# EAGLE board Krakatau Board v1.3 (EAGLE 9.6.0)
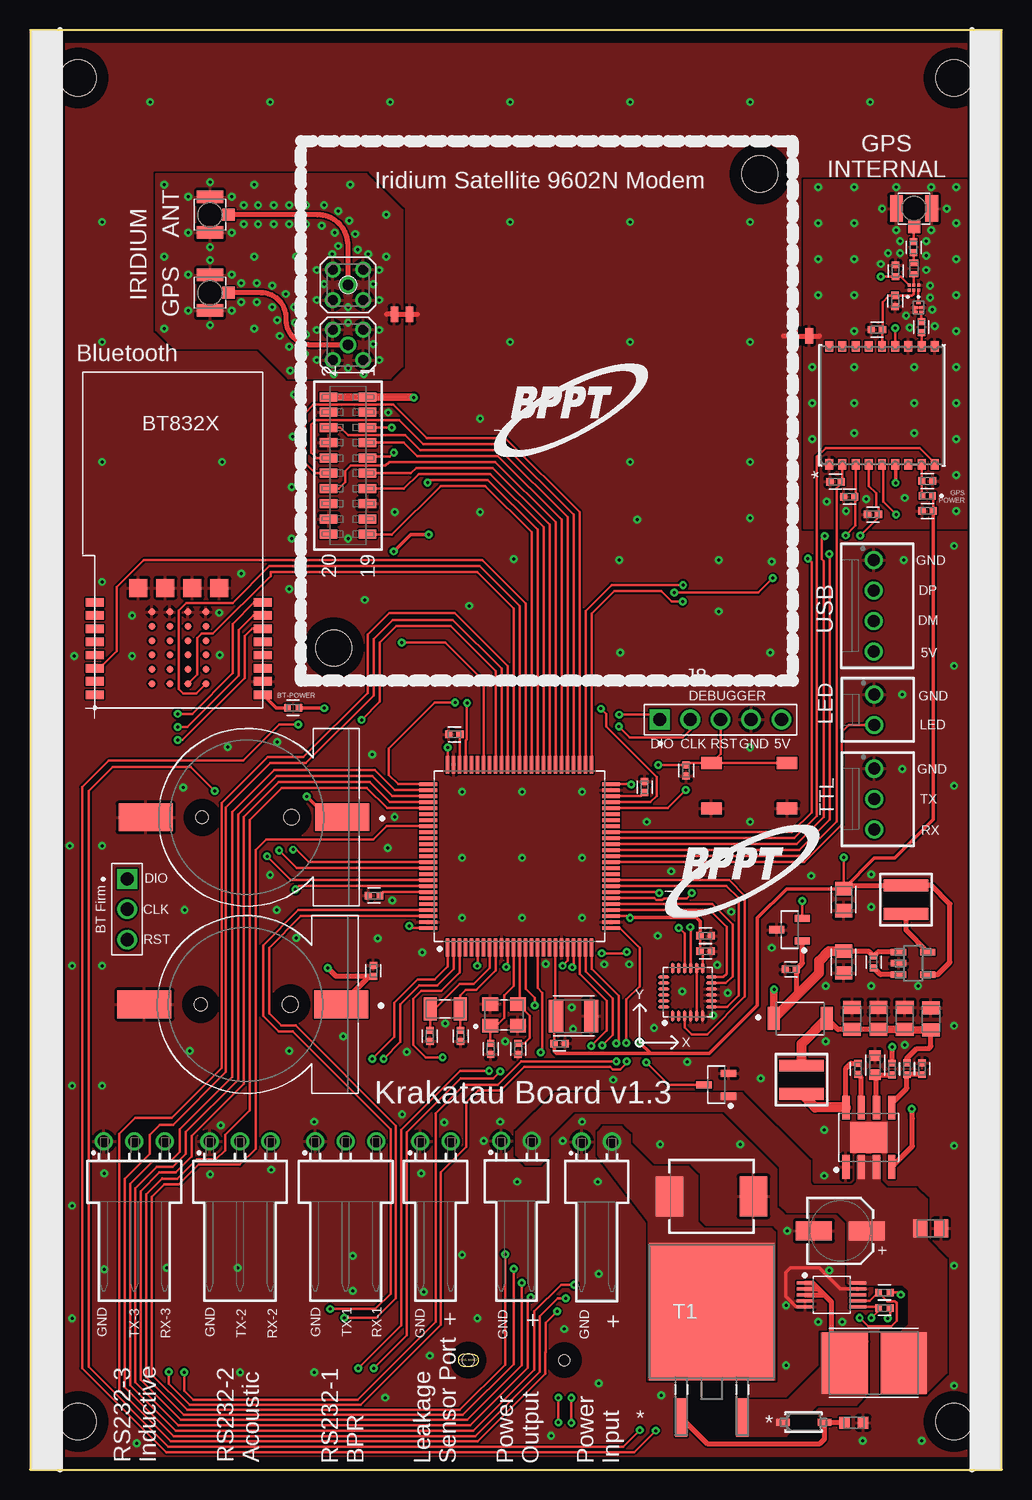
[diagram p7: board, top side]
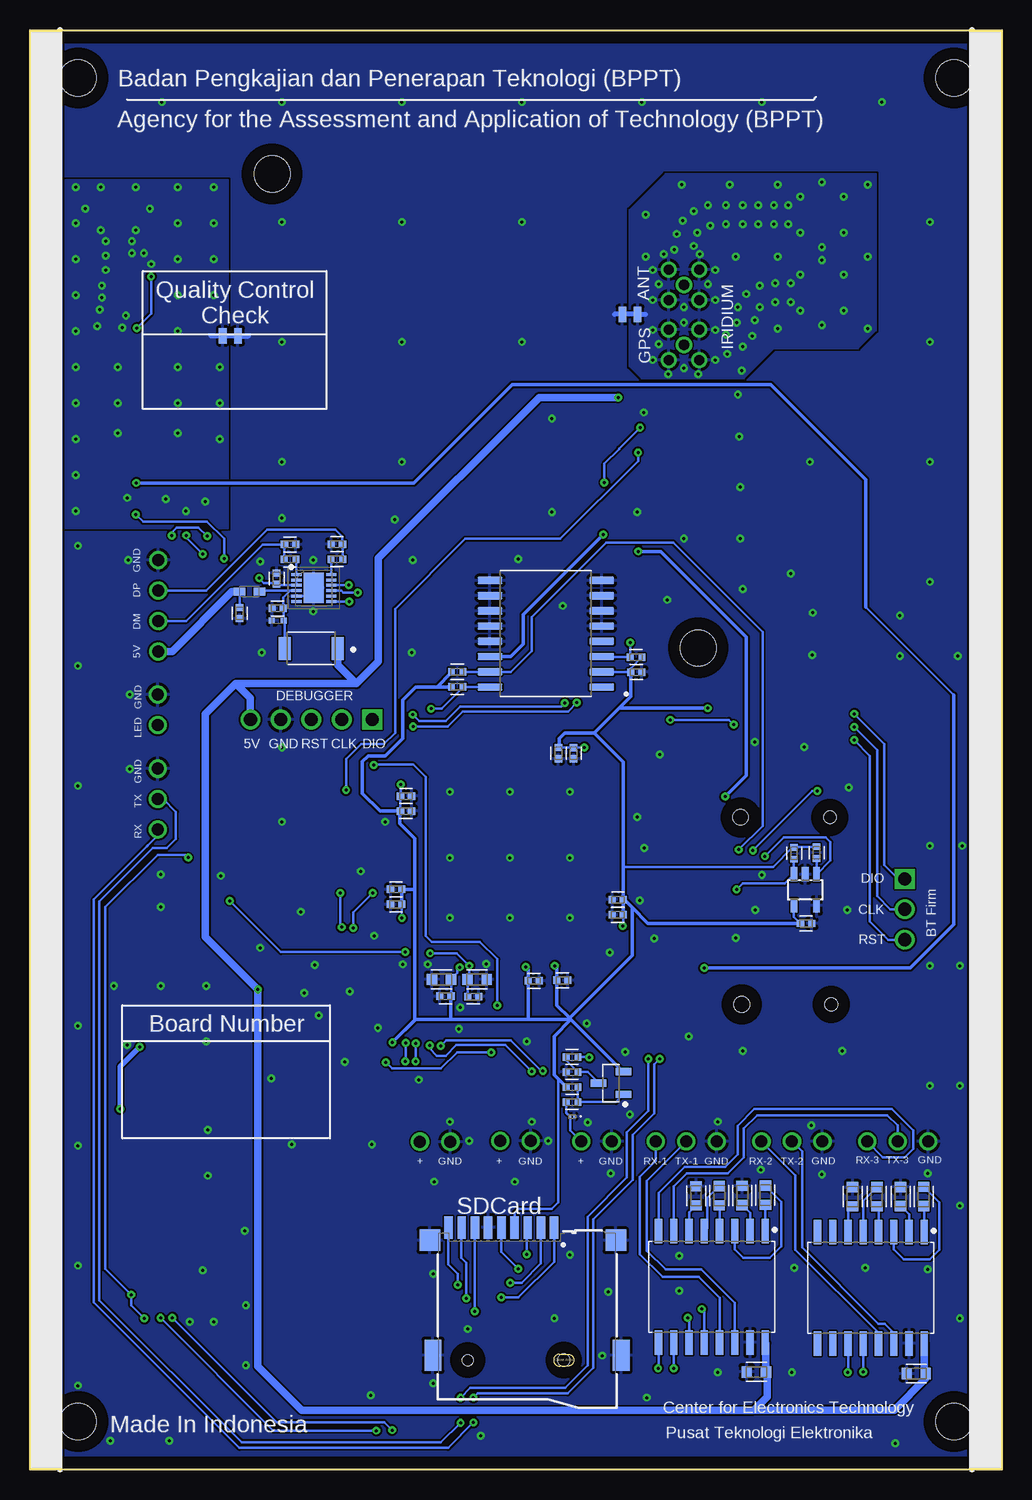
[diagram p8: board, bottom side, seen from below]

Size 81 x 120 mm. Coordinates in mm from the lower left corner, seen from the top.
Outline: 81,0 81,120 0,120 0,0 81,0
Copper layers (1*16): Top 0.035mm / dielectric 1.5mm / Bottom 0.035mm
Design rules "default *": minimum track width 6mil, minimum drill 0.2mm, track to track 6mil, track to pad 6mil, pad to pad 6mil, via to via 6mil, smd to smd 6mil, copper to edge 40mil, drill to drill 6mil, minimum pad ring 10mil, minimum via ring 8mil, stop-mask expansion 6mil, vias tented up to drill 13mil, thermal gap 10mil
Holes 3 mm at 25.31,68.49 60.82,108 77,4 4,4 4,116 77,116

## Footprints (pad centres in the part's own frame; a part is rotated, then mirrored left to right if it is on the bottom)
BAT_S8411-45R = smd 2.3 x 4.5: N 0,8.425; P 0,-7.975 | hole 1.3: 0,-3.725 | hole 1.05: 0,3.725
CAPC1005X50N-0402-KEMET = smd 0.598 x 0.623: 1 -0.463,0; 2 0.463,0
CAPC3225X90N-1210-KEMET = smd 1.185 x 2.715: 1 -1.465,0; 2 1.465,0
CAPC1608X80N-0603-KEMET = smd 0.86 x 0.95: 1 -0.795,0; 2 0.795,0
CAPC2113X90N-0805-KEMET = smd 1.11 x 1.4: 1 -0.91,0; 2 0.91,0
WCAP-AS5H_5X5.5(DXL) = smd 3 x 1.6: 1 2.2,0; 2 -2.2,0
CAPC2012X100N = smd 1.16 x 1.47: 1 -0.875,0; 2 0.875,0
CAPC2113X95N = smd 1.1 x 1.48: 1 -0.913,0; 2 0.913,0
WCAP-CSGP_0402 = smd 0.5 x 0.5: 1 0.5,0; 2 -0.5,0
WE-TVSP_DO-214AB_BIDIRECTIONAL = smd 2.3 x 3.3: 1 -3.5,0; 2 3.5,0
SODFL4725X110N = smd 0.99 x 1.92: A 2.21,0; C -2.21,0
SOD123_DIO = smd 1.111 x 0.601: 1 -1.725,0; 2 1.725,0
DIODFN58X28X16-2N = smd 0.22 x 0.28: 1 -0.18,0; 2 0.18,0
FIL_F6QA1G582H2JM-J = smd 0.25 x 0.35: 1 -0.4,0; 2 0,-0.25; 3 0.4,-0.25; 4 0.4,0.25; 5 0,0.25
MMCX-P-P-X-ST-TH1 = drill 0.84 pad 1.3: 1 0,0; 2 -1.27,1.27; 3 -1.27,-1.27; 4 1.27,1.27; 5 1.27,-1.27
61900211021 = drill 1: 1 -1.27,3.35; 2 1.27,3.35
61900311021 = drill 1: 1 -2.54,3.35; 2 0,3.35; 3 2.54,3.35
61300511121 = drill 1.1 square: 1 -5.08,0 | drill 1.1: 2 -2.54,0; 3 0,0; 4 2.54,0; 5 5.08,0
61900411121 = drill 1: 1 3.81,0.3; 2 1.27,0.3; 3 -1.27,0.3; 4 -3.81,0.3
693071020811 = smd 0.7 x 1.9: 1 2.25,11.05; 2 1.15,11.05; 3 0.05,11.05; 4 -1.05,11.05; 5 -2.15,11.05; 6 -3.25,11.05; 7 -4.35,11.05; 8 -5.45,11.05; 9 -6.55,11.05 | smd 1.7 x 1.8: 10 -8.1,10; 11 7.4,10 | smd 1.4 x 2.6: 12 -7.85,0.4; 13 7.85,0.4 | hole 0.9: -4.95,0 | hole 1: 3.05,0
SAMTEC-CLP-110-02-X-D = smd 0.74 x 1.47: 1 -5.715,1.613; 2 -5.715,-1.613; 3 -4.445,1.613; 4 -4.445,-1.613; 5 -3.175,1.613; 6 -3.175,-1.613; 7 -1.905,1.613; 8 -1.905,-1.613; 9 -0.635,1.613; 10 -0.635,-1.613; 11 0.635,1.613; 12 0.635,-1.613; 13 1.905,1.613; 14 1.905,-1.613; 15 3.175,1.613; 16 3.175,-1.613; 17 4.445,1.613; 18 4.445,-1.613; 19 5.715,1.613; 20 5.715,-1.613
61900211121 = drill 1: 1 1.27,0.3; 2 -1.27,0.3
61900311121 = drill 1: 1 2.54,0.3; 2 0,0.3; 3 -2.54,0.3
61300311121 = drill 1.1 square: 1 -2.54,0 | drill 1.1: 2 0,0; 3 2.54,0
WE-MAIA_4020 = smd 0.98 x 3.7: 1 -1.185,0; 2 1.185,0
WE-CBF_0603(W=2.6) = smd 0.95 x 0.7: 1 -0.825,0; 2 0.825,0
INDC1005X55N = smd 0.54 x 0.6: 1 -0.432,0; 2 0.432,0
INDC1006X60N = smd 0.51 x 0.73: 1 -0.46,0; 2 0.46,0
RESC1005X35N-0402-VISHAYDALE = smd 0.555 x 0.623: 1 -0.484,0; 2 0.484,0
RESC1005X30N = smd 0.555 x 0.623: 1 -0.484,0; 2 0.484,0
RESC1608X55N = smd 0.87 x 0.98: 1 -0.78,0; 2 0.78,0
RESM7149X165NR = smd 3.838 x 5.112: 1 -2.389,0; 2 2.515,0
2PT_GND_TIE = smd 1.27 x 0.635: P$1 0,0.635; P$2 0,-0.635
SW_TL3342F160QG = smd 1.7 x 1: 1 -3.15,-1.9; 2 3.15,-1.9; 3 -3.15,1.9; 4 3.15,1.9
TO-263AB_SUM = smd 0.991 x 3.2: 1 -2.54,-8.877; 3 2.54,-8.877 | smd 10.414 x 11.455: 2 0,-0.051
QFP50P1590X1590X160-100N = smd 1.488 x 0.28: 1 -7.62,6; 2 -7.62,5.5; 3 -7.62,5; 4 -7.62,4.5; 5 -7.62,4; 6 -7.62,3.5; 7 -7.62,3; 8 -7.62,2.5; 9 -7.62,2; 10 -7.62,1.5; 11 -7.62,1; 12 -7.62,0.5; 13 -7.62,0; 14 -7.62,-0.5; 15 -7.62,-1; 16 -7.62,-1.5; 17 -7.62,-2; 18 -7.62,-2.5; 19 -7.62,-3; 20 -7.62,-3.5; 21 -7.62,-4; 22 -7.62,-4.5; 23 -7.62,-5; 24 -7.62,-5.5; 25 -7.62,-6; 51 7.62,-6; 52 7.62,-5.5; 53 7.62,-5; 54 7.62,-4.5; 55 7.62,-4; 56 7.62,-3.5; 57 7.62,-3; 58 7.62,-2.5; 59 7.62,-2; 60 7.62,-1.5; 61 7.62,-1; 62 7.62,-0.5; 63 7.62,0; 64 7.62,0.5; 65 7.62,1; 66 7.62,1.5; 67 7.62,2; 68 7.62,2.5; 69 7.62,3; 70 7.62,3.5; 71 7.62,4; 72 7.62,4.5; 73 7.62,5; 74 7.62,5.5; 75 7.62,6 | smd 0.28 x 1.488: 26 -6,-7.62; 27 -5.5,-7.62; 28 -5,-7.62; 29 -4.5,-7.62; 30 -4,-7.62; 31 -3.5,-7.62; 32 -3,-7.62; 33 -2.5,-7.62; 34 -2,-7.62; 35 -1.5,-7.62; 36 -1,-7.62; 37 -0.5,-7.62; 38 0,-7.62; 39 0.5,-7.62; 40 1,-7.62; 41 1.5,-7.62; 42 2,-7.62; 43 2.5,-7.62; 44 3,-7.62; 45 3.5,-7.62; 46 4,-7.62; 47 4.5,-7.62; 48 5,-7.62; 49 5.5,-7.62; 50 6,-7.62; 76 6,7.62; 77 5.5,7.62; 78 5,7.62; 79 4.5,7.62; 80 4,7.62; 81 3.5,7.62; 82 3,7.62; 83 2.5,7.62; 84 2,7.62; 85 1.5,7.62; 86 1,7.62; 87 0.5,7.62; 88 0,7.62; 89 -0.5,7.62; 90 -1,7.62; 91 -1.5,7.62; 92 -2,7.62; 93 -2.5,7.62; 94 -3,7.62; 95 -3.5,7.62; 96 -4,7.62; 97 -4.5,7.62; 98 -5,7.62; 99 -5.5,7.62; 100 -6,7.62
SOT95P284X122-5N = smd 1.27 x 0.533: 1 -1.219,0.94; 2 -1.219,0; 3 -1.219,-0.94; 4 1.219,-0.94; 5 1.219,0.94
SOIC127P600X170-9T260X310N = smd 1.968 x 0.599: 1 -2.473,1.905; 2 -2.473,0.635; 3 -2.473,-0.635; 4 -2.473,-1.905; 5 2.473,-1.905; 6 2.473,-0.635; 7 2.473,0.635; 8 2.473,1.905 | smd 2.6 x 3.1: 9 0,0
SOT95P237X112-3N = smd 1.24 x 0.589: 1 -1.056,0.95; 2 -1.056,-0.95; 3 1.056,0
BT832X = smd 1.5 x 0.7: P$1 0,8.8; P$2 0,7.7; P$3 0,6.6; P$4 0,5.5; P$5 0,4.4; P$6 0,3.3; P$7 0,2.2; P$8 0,1.1; P$9 14,1.1; P$10 14,2.2; P$11 14,3.3; P$12 14,4.4; P$13 14,5.5; P$14 14,6.6; P$15 14,7.7; P$16 14,8.8 | smd 0.6 x 0.6: P$A0 4.75,8; P$A1 4.75,6.8; P$A2 4.75,5.6; P$A3 4.75,4.4; P$A4 4.75,3.2; P$A5 4.75,2; P$B0 6.25,8; P$B1 6.25,6.8; P$B2 6.25,5.6; P$B3 6.25,4.4; P$B4 6.25,3.2; P$B5 6.25,2; P$C0 7.75,8; P$C1 7.75,6.8; P$C2 7.75,5.6; P$C3 7.75,4.4; P$C4 7.75,3.2; P$C5 7.75,2; P$D0 9.25,8; P$D1 9.25,6.8; P$D2 9.25,5.6; P$D3 9.25,4.4; P$D4 9.25,3.2; P$D5 9.25,2 | smd 1.5 x 1.5: P$F0 3.63,10; P$F1 5.88,10; P$F2 8.13,10; P$F3 10.38,10
SOIC127P1030X265-16N = smd 2.056 x 0.599: 1 -4.642,4.445; 2 -4.642,3.175; 3 -4.642,1.905; 4 -4.642,0.635; 5 -4.642,-0.635; 6 -4.642,-1.905; 7 -4.642,-3.175; 8 -4.642,-4.445; 9 4.642,-4.445; 10 4.642,-3.175; 11 4.642,-1.905; 12 4.642,-0.635; 13 4.642,0.635; 14 4.642,1.905; 15 4.642,3.175; 16 4.642,4.445
SON45P300X300X75-13N = smd 0.85 x 0.25: 1 -1.45,1.125; 2 -1.45,0.675; 3 -1.45,0.225; 4 -1.45,-0.225; 5 -1.45,-0.675; 6 -1.45,-1.125; 7 1.45,-1.125; 8 1.45,-0.675; 9 1.45,-0.225; 10 1.45,0.225; 11 1.45,0.675; 12 1.45,1.125 | smd 1.65 x 2.55: 13 0,0
SOT95P237X110-3 = smd 1.298 x 0.602: 1 -1.027,0.95; 2 -1.027,-0.95; 3 1.027,0
LCC18_9P7X10P1 = smd 0.876 x 0.66: 1 -4.921,4.4; 2 -4.921,3.3; 3 -4.921,2.2; 4 -4.921,1.1; 5 -4.921,0; 6 -4.921,-1.1; 7 -4.921,-2.2; 8 -4.921,-3.3; 9 -4.921,-4.4; 10 4.921,-4.4; 11 4.921,-3.3; 12 4.921,-2.2; 13 4.921,-1.1; 14 4.921,0; 15 4.921,1.1; 16 4.921,2.2; 17 4.921,3.3; 18 4.921,4.4
INF-TSLP-6-2_V_1PRIMARY = smd 0.25 x 0.25: 1 -0.2,0.4; 2 -0.2,0; 3 -0.2,-0.4; 4 0.2,-0.4; 5 0.2,0; 6 0.2,0.4
SOIC127P1032X265-16N = smd 2.05 x 0.59: 1 -4.655,4.445; 2 -4.655,3.175; 3 -4.655,1.905; 4 -4.655,0.635; 5 -4.655,-0.635; 6 -4.655,-1.905; 7 -4.655,-3.175; 8 -4.655,-4.445; 9 4.655,-4.445; 10 4.655,-3.175; 11 4.655,-1.905; 12 4.655,-0.635; 13 4.655,0.635; 14 4.655,1.905; 15 4.655,3.175; 16 4.655,4.445
SOT23-5L = smd 0.55 x 1.2: GND 0,-1.3; SCL -0.95,-1.3; SDA 0.95,-1.3; VCC 0.95,1.3; WP -0.95,1.3
SOP50P490X110-10N = smd 1.396 x 0.28: 1 -2.187,1; 2 -2.187,0.5; 3 -2.187,0; 4 -2.187,-0.5; 5 -2.187,-1; 6 2.187,-1; 7 2.187,-0.5; 8 2.187,0; 9 2.187,0.5; 10 2.187,1
QFN50P400X400X100-24 = smd 0.96 x 0.27: 1 -1.985,1.25; 2 -1.985,0.75; 3 -1.985,0.25; 4 -1.985,-0.25; 5 -1.985,-0.75; 6 -1.985,-1.25; 13 1.985,-1.25; 14 1.985,-0.75; 15 1.985,-0.25; 16 1.985,0.25; 17 1.985,0.75; 18 1.985,1.25 | smd 0.27 x 0.96: 7 -1.25,-1.985; 8 -0.75,-1.985; 9 -0.25,-1.985; 10 0.25,-1.985; 11 0.75,-1.985; 12 1.25,-1.985; 19 1.25,1.985; 20 0.75,1.985; 21 0.25,1.985; 22 -0.25,1.985; 23 -0.75,1.985; 24 -1.25,1.985
XTAL_ECS-250-20-33-CKM-TR = smd 1.3 x 1.1: 1 -1.15,-0.9; 2 1.15,-0.9; 3 1.15,0.9; 4 -1.15,0.9
XTAL_ECS-.327-12.5-34B-TR = smd 1.1 x 1.9: 1 -1.25,0; 2 1.25,0
HRS_U.FL-R-SMT-1(10) = smd 1.05 x 2.2: 1 -1.475,0; 3 1.475,0 | smd 1 x 1.05: 2 0,-1.525

## Placement (x,y rotation side)
BT1  S8411-45R  [BAT_S8411-45R]  17.96,38.77 90 top
BT2  S8411-45R  [BAT_S8411-45R]  18.06,54.37 90 top
C1  2.2uF  [CAPC1005X50N-0402-KEMET]  51.21,56.89 90 top
C2  2.2uF  [CAPC1005X50N-0402-KEMET]  35.37,61.29 180 top
C3  0.1uF  [CAPC1005X50N-0402-KEMET]  54.68,58.27 270 top
C4  20pF  [CAPC1005X50N-0402-KEMET]  40.68,35.07 270 top
C5  20pF  [CAPC1005X50N-0402-KEMET]  38.4,35.07 270 top
C6  12pF  [CAPC1005X50N-0402-KEMET]  35.88,36.14 270 top
C7  12pF  [CAPC1005X50N-0402-KEMET]  33.32,36.14 270 top
C8  4.7uF  [CAPC3225X90N-1210-KEMET]  45.3,37.81 0 top
C9  0.1uF  [CAPC1005X50N-0402-KEMET]  39.01,40.73 0 bottom
C10  0.1uF  [CAPC1005X50N-0402-KEMET]  50.49,47.11 180 bottom
C11  0.1uF  [CAPC1005X50N-0402-KEMET]  49.67,54.88 0 bottom
C12  0.1uF  [CAPC1005X50N-0402-KEMET]  49.67,56.13 0 bottom
C13  0.1uF  [CAPC1005X50N-0402-KEMET]  35.7,59.71 270 bottom
C14  0.1uF  [CAPC1005X50N-0402-KEMET]  36.96,59.71 270 bottom
C15  0.1uF  [CAPC1005X50N-0402-KEMET]  32.02,46.24 180 bottom
C16  0.1uF  [CAPC1005X50N-0402-KEMET]  36.63,40.77 0 bottom
C17  0.1uF  [CAPC1005X50N-0402-KEMET]  50.49,48.37 180 bottom
C18  0.1uF  [CAPC1005X50N-0402-KEMET]  32.01,47.5 180 bottom
C19  0.1uF  [CAPC1005X50N-0402-KEMET]  44.14,35.52 0 top
C20  1uF  [CAPC1608X80N-0603-KEMET]  43.73,40.86 0 bottom
C21  1uF  [CAPC1608X80N-0603-KEMET]  46.71,40.86 180 bottom
C22  0.1uF  [CAPC1005X50N-0402-KEMET]  44.06,39.43 0 bottom
C23  0.1uF  [CAPC1005X50N-0402-KEMET]  46.38,39.44 180 bottom
C24  0.1uF  [CAPC1005X50N-0402-KEMET]  28.62,41.57 90 top
C25  4.7uF  [CAPC2113X90N-0805-KEMET]  67.8,42.3 270 top
C26  10uF  [CAPC2113X90N-0805-KEMET]  67.8,47.5 270 top
C27  10 µF  [WCAP-AS5H_5X5.5(DXL)]  67.53,19.89 0 top
C28  220nF  [CAPC2012X100N]  75.05,20.11 180 top
C29  22uF  [CAPC2113X95N]  68.5,37.6 270 top
C30  22uF  [CAPC2113X95N]  75.08,37.57 270 top
C31  0.1uF  [CAPC1005X50N-0402-KEMET]  69,33.4 90 top
C32  1uF  [CAPC1608X80N-0603-KEMET]  70.42,33.7 90 top
C33  0.47uF  [CAPC1005X50N-0402-KEMET]  63.4,41.7 180 top
C34  1uF  [CAPC1608X80N-0603-KEMET]  19.72,22.86 90 bottom
C35  1uF  [CAPC1608X80N-0603-KEMET]  23.56,22.82 90 bottom
C36  1uF  [CAPC1608X80N-0603-KEMET]  21.65,22.85 270 bottom
C37  1uF  [CAPC1608X80N-0603-KEMET]  25.49,22.81 90 bottom
C38  1uF  [CAPC1608X80N-0603-KEMET]  20.47,8.13 180 bottom
C39  1uF  [CAPC1608X80N-0603-KEMET]  7.14,8 180 bottom
C40  1uF  [CAPC1608X80N-0603-KEMET]  6.52,22.76 90 bottom
C41  1uF  [CAPC1608X80N-0603-KEMET]  10.43,22.74 90 bottom
C42  1uF  [CAPC1608X80N-0603-KEMET]  8.44,22.75 270 bottom
C43  1uF  [CAPC1608X80N-0603-KEMET]  12.44,22.74 90 bottom
C44  47pF  [CAPC1005X50N-0402-KEMET]  59.32,77.11 0 bottom
C45  47pF  [CAPC1005X50N-0402-KEMET]  55.42,77.13 180 bottom
C46  10nF  [CAPC1005X50N-0402-KEMET]  63.52,71.39 90 bottom
C47  0.1uF  [CAPC1005X50N-0402-KEMET]  60.36,71.78 180 bottom
C48  4.7 µF  [WCAP-CSGP_0402]  60.34,70.77 180 bottom
C49  0.1uF  [CAPC1005X50N-0402-KEMET]  60.45,74.27 90 bottom
C50  10nF  [CAPC1005X50N-0402-KEMET]  74.8,79.91 180 top
C51  56pF  [CAPC1005X50N-0402-KEMET]  74.77,82.4 0 top
C52  56pF  [CAPC1005X50N-0402-KEMET]  68.28,81.09 0 top
C53  56pF  [CAPC1005X50N-0402-KEMET]  67.13,82.35 0 top
C54  56pF  [CAPC1005X50N-0402-KEMET]  70.25,79.61 0 top
C55  56pF  [CAPC1005X50N-0402-KEMET]  70.58,95.02 0 top
C56  120pF  [CAPC1005X50N-0402-KEMET]  74.29,95.23 90 top
C57  120pF  [CAPC1005X50N-0402-KEMET]  73.64,101.89 90 top
C58  1nF  [CAPC1005X50N-0402-KEMET]  72.1,97.41 270 top
C59  0.1uF  [CAPC1005X50N-0402-KEMET]  30.47,66.46 0 bottom
C60  0.1uF  [CAPC1005X50N-0402-KEMET]  16.32,45.52 0 bottom
C61  0.1uF  [CAPC1005X50N-0402-KEMET]  56.3,44.5 0 top
C62  10uF  [CAPC1005X50N-0402-KEMET]  56.3,43.2 0 top
C63  22uF  [CAPC2113X95N]  70.7,37.6 270 top
C64  22uF  [CAPC2113X95N]  72.9,37.6 270 top
D1  36V  [WE-TVSP_DO-214AB_BIDIRECTIONAL]  56.79,22.77 0 top
D2  PMEG3050EP  [SODFL4725X110N]  64.2,37.6 0 top
D3  BZT52C12-13-F  [SOD123_DIO]  64.47,3.94 0 top
D4  ESD234B1W0201E6327XTSA1  [DIODFN58X28X16-2N]  35.81,29.43 180 bottom
D5  PMEG3050EP  [SODFL4725X110N]  57.57,68.45 180 bottom
FL1  F6QA1G582H2JM-J  [FIL_F6QA1G582H2JM-J]  74.04,96.86 270 top
J1  MMCX-P-P-X-ST-TH1  [MMCX-P-P-X-ST-TH1]  26.5,93.75 0 top
J2  MMCX-P-P-X-ST-TH1  [MMCX-P-P-X-ST-TH1]  26.5,98.75 0 top
J3  [61900211021]  47.23,23.98 0 top
J4  [61900311021]  26.3,24 0 top
J5  [61900211021]  33.8,24 0 top
J6  [61900311021]  17.5,24 0 top
J7  [61900311021]  8.7,24 0 top
J8  61300511121  [61300511121]  57.55,62.52 0 top
J9  [61900411121]  70.6,72 90 top
J10  [693071020811]  39.57,9.12 0 bottom
J11  [61900211021]  40.53,24.03 0 top
J12  SAMTEC-CLP-110-02-X-D  [SAMTEC-CLP-110-02-X-D]  26.5,83.69 270 top
J13  [61900211121]  70.66,63.32 90 top
J14  [61900311121]  70.65,55.88 90 top
J15  61300311121  [61300311121]  8.1,46.7 270 top
L1  2.2uH  [WE-MAIA_4020]  73,47.5 90 top
L2  2.2uH  [WE-MAIA_4020]  64.3,32.49 90 top
L3  600Ohm@100MHz  [WE-CBF_0603(W=2.6)]  62.7,73.19 180 bottom
L4  LQG15HS27NJ02D  [INDC1005X55N]  74.76,81.16 0 top
L5  5.6nH  [INDC1006X60N]  73.65,100.12 90 top
R1  10K  [RESC1005X35N-0402-VISHAYDALE]  28.67,47.84 0 top
R2  100K  [RESC1005X35N-0402-VISHAYDALE]  70.3,42.3 270 top
R3  100K  [RESC1005X35N-0402-VISHAYDALE]  73.08,33.41 90 top
R4  24.9K  [RESC1005X30N]  74.34,33.41 270 top
R5  100K  [RESC1005X35N-0402-VISHAYDALE]  71.84,33.38 270 top
R6  0  [RESC1005X30N]  21.93,63.5 0 top
R7  27  [RESC1005X30N]  59.32,75.86 180 bottom
R8  27  [RESC1005X30N]  55.42,75.88 0 bottom
R9  10K  [RESC1005X35N-0402-VISHAYDALE]  72.14,99.92 270 top
R10  10K  [RESC1005X35N-0402-VISHAYDALE]  45.39,66.5 180 bottom
R11  10K  [RESC1005X35N-0402-VISHAYDALE]  45.39,65.24 180 bottom
R12  10K  [RESC1005X35N-0402-VISHAYDALE]  30.49,67.71 0 bottom
R13  10K  [RESC1005X35N-0402-VISHAYDALE]  17.33,51.37 90 bottom
R14  10K  [RESC1005X35N-0402-VISHAYDALE]  15.44,51.42 90 bottom
R15  2K  [RESC1005X35N-0402-VISHAYDALE]  71.2,14.76 0 top
R16  2K  [RESC1005X35N-0402-VISHAYDALE]  71.2,13.46 0 top
R17  10K  [RESC1608X55N]  68.65,3.9 0 top
R18  20K  [RESC1005X35N-0402-VISHAYDALE]  35.82,30.64 0 bottom
R19  560K  [RESC1005X35N-0402-VISHAYDALE]  35.82,31.89 0 bottom
R20  560K  [RESC1005X35N-0402-VISHAYDALE]  35.82,33.14 180 bottom
R21  0  [RESC1005X35N-0402-VISHAYDALE]  35.82,34.39 180 bottom
RS1  HCSM2818FT20L0_2  [RESM7149X165NR]  70.3,8.88 0 top
SUPPLY4  2PT_GND_TIE  [2PT_GND_TIE]  31,96.3 90 top
SUPPLY5  2PT_GND_TIE  [2PT_GND_TIE]  64.3,94.5 90 top
SUPPLY6  2PT_GND_TIE  [2PT_GND_TIE]  64.3,94.5 270 bottom
SUPPLY7  2PT_GND_TIE  [2PT_GND_TIE]  31,96.3 270 bottom
SW1  TL3342F160QG  [SW_TL3342F160QG]  59.94,56.99 0 top
T1  SUM110P06-07L-E3  [TO-263AB_SUM]  56.81,13.2 0 top
U1  STM32F413VHT6  [QFP50P1590X1590X160-100N]  40.8,51.13 90 top
U2  LM3671MF-3.3  [SOT95P284X122-5N]  73.6,42.2 0 top
U3  LMR33630ADDAR  [SOIC127P600X170-9T260X310N]  69.9,27.7 90 top
U4  REF2933AIDBZR  [SOT95P237X112-3N]  63.3,45 180 top
U5  BT832X  [BT832X]  5.4,63.5 0 top
U6  MAX232E  [SOIC127P1030X265-16N]  24.17,15.23 270 bottom
U7  MAX232E  [SOIC127P1030X265-16N]  10.92,15.15 270 bottom
U8  FT234XD-R  [SON45P300X300X75-13N]  57.34,73.49 0 bottom
U9  MAX5490  [SOT95P237X110-3]  57.19,32.07 180 top
U10  TESEO-LIV3F  [LCC18_9P7X10P1]  71,88.7 90 top
U11  BGA725L6E6327FTSA1  [INF-TSLP-6-2_V_1PRIMARY]  73.65,98.53 90 top
U12  DS3231S  [SOIC127P1032X265-16N]  38.01,69.67 180 bottom
U13  24LC01B  [SOT23-5L]  16.39,48.32 180 bottom
U14  LTC4151IMS  [SOP50P490X110-10N]  66.8,14.56 0 top
U15  MMBT2907ALT1GSOT-23-3D  [SOT95P237X110-3]  32.58,32.21 180 bottom
U16  IIS328DQ  [QFN50P400X400X100-24]  54.8,39.8 90 top
Y1  ECS-250-20-33-CKM-TR  [XTAL_ECS-250-20-33-CKM-TR]  39.5,37.9 0 top
Y2  ECS-.327-12.5-34B-TR  [XTAL_ECS-.327-12.5-34B-TR]  34.6,38.4 0 top
Y3  U.FL  [HRS_U.FL-R-SMT-1(10)]  73.67,105.11 0 top
Y4  U.FL  [HRS_U.FL-R-SMT-1(10)]  15,98.1 90 top
Y5  U.FL  [HRS_U.FL-R-SMT-1(10)]  15,104.6 90 top

## Tracks (layer width: path | path; a pad name or v marks a point on that pad's centre or on a via)
+3V3  (via drill 0.25)
  Top 0.2: U1.22 45.3,41.97 v45.2,41.87 | C19.1 43.67,37.64 C8.1 43.76,37.88 43.76,43.47 U1.19 | U1.75 v34.8,60.2 | U1.100 31.77,45.13 v31.6,45.3 | U1.28 49.84,46.13 v50,45.97 | U1.50 50.07,57.13 v50.1,57.1 | C61.1 C62.1 56.05,42.99 U16.13 U16.14 U16.5 | C50.1 75.26,79.98 75.26,81.09 L4.2 | R16.2 71.68,12.81 v71.47,12.6 | R15.2 72.39,14.76 v72.57,14.58 | C26.1 67.8,50.99 v67.82,51.01 | U1.6 37.3,42.04 v37.26,42 | U1.11 39.8,42.02 v39.68,41.9
  Top 0.305: 51.72,34.67 43.87,34.67 43.67,34.87 C19.1 | v50,45.97 50.06,46.03 55.5,46.03 55.84,45.69 C61.1 | 75.26,79.98 75.26,54.18 72.06,50.98 70.37,50.98 C26.1 63.05,48.41 60.61,45.97 60.61,38.69 56.59,34.67 51.72,34.67 | R6.2 24.49,63.5 v24.53,63.46 | v50.79,35.6 51.72,34.67
  Top 0.406: C26.1 68.08,48.69 L1.2 75.12,48.69 76.65,47.16 76.65,42.28 75.63,41.26 U2.4
  Bottom 0.2: C23.1 45.91,39.45 C21.1 45.38,41.39 45.38,41.69 v45.2,41.87 | v50,45.97 50,47.08 C10.1 | v31.6,45.3 31.55,45.35 C15.1 | v34.8,60.2 35.68,60.2 C13.1 36.91,60.17 C14.1 | v50.1,57.1 50.1,56.16 C12.1 C11.1 | C11.1 | U12.2 33.32,66.46 C59.1 30.93,66.78 R12.2 | U13.VCC 17.34,46.08 C60.1 | v71.47,12.6 72.57,13.7 v72.57,14.58 74.72,16.73 74.72,46.88 70.36,51.24 67.92,51.24 67.82,51.14 v67.82,51.01 | R14.2 17.28,51.9 R13.2 17.46,51.85 19.07,50.24 31.55,50.24 | 36.98,32.57 36.98,22.28 37.52,21.74 40.28,21.74 40.62,21.4 J10.4
  Bottom 0.305: C23.1 45.92,37.67 46.06,37.53 | 46.06,37.53 39.46,37.53 | 39.46,37.53 36.15,37.53 | 36.15,37.53 36.03,37.65 | 36.03,37.65 30.82,42.86 30.82,46.85 | 30.82,46.85 31.48,47.5 C18.1 | C18.1 31.55,50.24 31.55,58.99 33.97,61.41 | 33.97,61.41 36.44,61.41 36.91,60.94 36.91,60.17 | 33.97,61.41 31.91,63.47 | 31.91,63.47 30.93,64.45 C59.1 | R10.2 45.87,66.42 47.05,65.24 | R11.2 47.05,65.24 | 47.05,65.24 48.84,65.24 49.92,64.16 49.92,60.94 51.39,59.47 52.82,59.47 53.29,59 53.29,56.37 51.8,54.88 C11.1 50.18,54.83 50.18,53.85 48.93,52.6 48.93,48.34 | U15.2 35.92,37.53 | 35.92,37.53 36.15,37.53 | R19.1 36.98,32.57 37.33,32.92 37.33,36.12 35.92,37.53 | 46.06,37.53 48.86,37.53 v50.79,35.6 48.93,37.46 48.93,48.34 | v24.53,63.46 31.9,63.46 31.91,63.47 | C60.1 29.5,45.52 30.82,46.85 | C18.1 C15.1 | C17.1 49.99,48.34 48.93,48.34 | C17.1 | C17.1 C10.1 | v37.26,42 37.1,41.84 C16.1 37.1,38.71 36.03,37.65 | v39.68,41.9 39.47,41.69 C9.1 39.47,37.54 39.46,37.53
+5V  (via drill 0.25)
  Top 0.406: U2.1 70.66,43.14 R2.1 69.87,43.21 C25.1 | D2.C 63.86,39.47 C33.1 64.36,42.19 U4.1
  Top 0.61: D2.C v61.99,40.01 v62,40.02 | J12.2 J12.1 31.95,89.41 v31.99,89.36
  Top 0.813: D2.C 65.77,41.38 65.77,42.41 66.57,43.21 C25.1
  Bottom 0.61: v31.99,89.36 38.57,89.36 51.96,75.97 51.96,67.36 53.8,65.52 | 63.85,65.52 66.39,62.98 66.39,44.41 v62,40.02 62,8.6 58.35,4.95 20.67,4.95 | 53.8,65.52 63.85,65.52 | J8.5 62.63,64.3 63.85,65.52 | D5.C 55.36,67.08 53.8,65.52 | U6.16 19.68,10.54 C38.1 19.57,8.03 19.57,6.05 20.67,4.95 | U7.16 6.47,8.13 C39.1 6.34,7.58 8.98,4.95 20.67,4.95
+24V
  pour Top (no thermals): 68.94,26.05 70.78,26.05 70.8,26.03 70.8,23.99 71.4,23.39 73.83,23.39 74.71,22.51 74.71,19.14 76.37,17.48 76.37,8.05 74.62,6.3 70.96,6.3 70.96,11.4 72.53,11.4 73.25,12.12 73.25,14.89 72.7,15.44 68.27,15.44 68.14,15.57 68.14,20.65 67.32,21.47 63.09,21.47 62.52,22.04 62.52,25.17 57.81,29.88 45.32,29.88 43.2,27.76 43.2,26.09 42.54,25.43 41.33,25.43 40.54,26.22 40.54,28.16 43.75,31.37 59.33,31.37 64.97,25.73 64.97,23.84 65.2,23.61 68.55,23.61 68.93,23.99 68.93,26.03
ACC_INT1
  Top 0.2: U1.33 48.45,48.66 58.04,48.66 59.06,47.64 59.06,39.52 58.09,38.55 U16.7
ACC_INT2
  Top 0.2: U1.34 58.28,49.13 59.58,47.83 59.58,39.44 56.43,36.29 55.13,36.29 54.55,36.87 U16.3
ACC_MISO  (via drill 0.25)
  Top 0.2: U1.31 52.03,47.63 52.18,47.48 52.7,47.48 52.84,47.62 54.71,47.62 v55.14,48.05 | U16.15 55.05,45.19 v55.03,45.21
  Bottom 0.2: v55.14,48.05 55.14,45.32 v55.03,45.21
ACC_MOSI  (via drill 0.25)
  Top 0.2: U1.32 52.39,48.13 v52.45,48.07 | v54.07,45.15 54.55,44.67 U16.16
  Bottom 0.2: v52.45,48.07 54.07,46.45 v54.07,45.15
ACC_NSS
  Top 0.2: U1.29 56.65,46.63 58.05,45.23 58.05,41.31 57.79,41.05 U16.12
ACC_SCK
  Top 0.2: U1.30 56.86,47.13 58.55,45.44 58.55,41.1 58,40.55 U16.11
AGND  (via drill 0.25)
  Top 0.2: FL1.3 FL1.2 FL1.5
  Top 0.406: SUPPLY6.P$2 65.8,94.5
  Bottom 0.406: SUPPLY6.P$2 65.9,94.5
  other vias: 66.4,80.7 68,79.9 69.7,80.9 72.9,81 75.1,106.9 76.4,105.1 72.2,106.9 71,105.1 72.2,103.3 75.1,103.3 74.7,102.4 74.7,101.2 74.7,100 72.5,102.4 72.5,101.4 70.9,100.5 71.5,101.4 75,98.7 75,97.7 75.2,96.7 73.3,95.2 75.4,95.3 73,96.2 65.7,106.9 68.7,106.9 68.7,103.9 65.7,103.9 65.7,100.9 68.7,100.9 68.7,97.9 65.7,97.9 68.7,94.9 77.2,106.9 77.2,103.9 77.2,100.9 77.2,97.9 77.2,94.9 77.2,91.9 77.2,88.9 77.2,85.9 77.2,82.9 77.2,79.9 65.2,91.9 65.2,88.9 65.2,85.9 68.7,91.9 73.7,91.9 73.7,88.9 68.7,88.9 68.7,86.4 73.7,86.4
  pour Top (rank 5): 64.5,107.5 78,107.5 78,78.5 64.5,78.5
  pour Bottom (rank 5): 64.5,107.5 64.5,78.5 78,78.5 78,107.5
ANTOFF  (via drill 0.25)
  Top 0.2: U11.6 72.54,99.44 R9.2 72.13,99.45 v70.91,99.45 | U10.13 v72.1,95.15 v72.09,95.16
  Bottom 0.2: v70.91,99.45 v70.9,99.44 70.9,96.35 v72.09,95.16
BATTSENSE  (via drill 0.25)
  Top 0.2: U9.3 53.23,32.07 v51.35,33.95 | U1.16 42.3,40.14 42.69,39.75 42.69,34.92 v42.55,34.78
  Bottom 0.2: v42.55,34.78 45.4,34.78 46.76,33.42 50.82,33.42 v51.35,33.95
BOOT0
  Top 0.2: U1.94 29.44,48.13 R1.2
BT_CLK  (via drill 0.25)
  Top 0.2: U5.P$15 18.6,71.2 17.4,70 17.4,66.2 13.1,61.9 v12.3,61.9
  Bottom 0.2: v12.3,61.9 10.4,60 10.4,47.8 9.3,46.7 J15.2
BT_CON
  Top 0.2: U1.62 41.3,72.2 37.7,75.8 9.47,75.8 7.21,73.54 7.21,68.22 5.8,66.8 U5.P$6
BT_DIO  (via drill 0.25)
  Top 0.2: U5.P$16 18.7,72.3 16.9,70.5 16.9,66.4 13.5,63 v12.3,63
  Bottom 0.2: v12.3,63 9.8,60.5 9.8,50.4 8.64,49.24 J15.1
BT_RESET  (via drill 0.25)
  Top 0.2: U5.P$14 18.5,70.1 17.9,69.5 17.9,66 12.7,60.8 v12.3,60.8
  Bottom 0.2: v12.3,60.8 11,59.5 11,45.7 9.46,44.16 J15.3
BT_RX
  Top 0.2: U1.64 40.3,71.79 37.29,74.8 20.05,74.8 20.05,74.5 15.24,69.69 14.3,69.69 13.94,69.33 13.94,66.29 U5.P$C5
BT_TX
  Top 0.2: U1.63 40.8,72 37.5,75.3 19.94,75.3 16.88,72.24 13.03,72.24 12.4,71.61 12.4,65.06 12.75,64.71 13.86,64.71 U5.P$D5
CD  (via drill 0.25)
  Top 0.2: U1.77 30.4,56.63 28.71,58.32 20.34,58.32 16.85,54.83 16.85,32.75 12.47,28.37 12.47,26.48 11.72,25.73 10.25,25.73 8.34,23.82 8.34,7.02 12.14,3.22 36.94,3.22 42.03,8.31 42.03,13.17 44.25,15.39 v45.35,15.39
  Bottom 0.2: v45.35,15.39 45.35,16.32 46.15,17.12 46.15,20.14 J10.9
CLK  (via drill 0.25)
  Top 0.2: U1.76 30.67,57.13 29.9,57.9 29.9,60.1 33.73,63.93 v35.42,63.93 | v49.08,61.95 49.99,61.04 54.4,61.04 55.01,61.65 J8.2
  Bottom 0.2: v35.42,63.93 36.16,63.19 44.94,63.19 46.18,61.95 v49.08,61.95
DF_CTS
  Top 0.2: U1.58 43.3,78.77 38.57,83.5 32.17,83.5 31.73,83.06 J12.11
DF_DCD  (via drill 0.25)
  Top 0.2: U1.46 53.15,55.13 v54.66,56.64 | v30.33,84.78 29.98,84.42 28.21,84.42 J12.9
  Bottom 0.2: v54.66,56.64 54.66,59.21 53.4,60.47 51.5,60.47 50.58,61.39 50.58,71.75 44.73,77.6 36.81,77.6 30.33,84.08 v30.33,84.78
DF_DSR
  Top 0.2: U1.54 45.3,79.6 39.4,85.5 32.77,85.5 30.78,87.49 23.83,87.49 23.44,87.1 23.44,84.76 23.88,84.33 J12.10
DF_DTR
  Top 0.2: U1.57 43.8,78.98 38.78,84 29.93,84 29.61,83.68 26.72,83.68 26.26,83.22 26.26,82.3 25.75,81.78 J12.14
DF_RI
  Top 0.2: U1.53 45.8,79.81 39.61,86 33.05,86 30.28,88.77 23.62,88.77 22.89,88.04 22.89,83.92 23.75,83.06 J12.12
DF_RTS
  Top 0.2: U1.59 42.8,78.56 38.36,83 32.4,83 31.16,81.76 28.14,81.76 J12.13
DF_S_RX
  Top 0.2: U1.56 44.3,79.19 38.99,84.5 34.36,84.5 34.25,84.5 32.25,84.5 31.16,85.59 J12.7
DF_S_TX
  Top 0.2: U1.55 44.8,79.39 39.19,85 32.5,85 31.27,86.23 26.5,86.23 25.86,86.86 J12.6
DIO  (via drill 0.25)
  Top 0.2: U1.72 36.3,60.79 36.38,60.87 36.38,63.87 v36.42,63.91 | v49.09,62.92 52.07,62.92 J8.1
  Bottom 0.2: v36.42,63.91 36.74,63.59 45.15,63.59 46.36,62.38 48.55,62.38 v49.09,62.92
EEPROM_SCL  (via drill 0.25)
  Top 0.2: v19.75,51.12 21.74,49.13 U1.92
  Bottom 0.2: R14.1 U13.SCL 14.3,50.76 14.3,52.3 14.7,52.7 18.17,52.7 v19.75,51.12
EEPROM_SDA  (via drill 0.25)
  Top 0.2: v22.12,48.35 22.4,48.63 U1.93
  Bottom 0.2: R13.1 17.34,50.88 U13.SDA 18.11,48.85 21.62,48.85 v22.12,48.35
GND  (via drill 0.25)
  Top 0.305: U14.9 67.53,15.06 65.79,16.8 63.37,16.8 62.99,16.42 62.99,14.44 63.87,13.56 U14.5
  Top 0.406: SUPPLY6.P$1 62.8,94.5 | SUPPLY7.P$2 32.3,96.3
  Bottom 0.2: U8.5 58.77,72.8 57.4,72.8 57.34,72.86 U8.13
  Bottom 0.406: SUPPLY6.P$1 62.8,94.5 | SUPPLY7.P$2 32.3,96.3
  other vias: 28.51,59.59 29.81,51.81 30.38,54.39 53.43,49.87 57.28,42.06 58.14,39.74 37.29,12.61 44.51,11.71 43.42,2.81 34.51,28.93 54.76,33.99 20.57,46.66 20,49.56 20.61,60.66 45.25,36.72 30.18,47.44 58.43,46.5 15.76,71.42 42.98,42.15 36,56.5 41,56.5 46,56.5 36,51 36,46 41,51 46,51 46,46 41,46 29.86,88.12 57.39,71.54 12.78,56.84 12.88,46.64 16.48,60.24 56.94,37.84 54.34,39.84 28.97,44.26 47.85,42.12 49.95,42.12 45.15,38.52 70,114 60,114 50,114 40,114 30,114 20,114 10,114 40,104 50,104 60,104 60,94 50,94 40,94 60,84 50,84 6,104 6,94 6,84 6,74 16,84 77,77 77,67 77,57 6,52 6,42 3.3,52 3.5,42 6,32 3.5,32 3.5,22 3.5,12.6 8.9,2.2 17.5,8.1 23.7,8.1 17.3,16.8 26.9,14.9 26.9,17.8 32.8,14.8 32.6,24.7 20.1,25 15,24.6 6.2,24.7 11.4,16.8 6.2,16.7 15.9,28.7 36,17.9 33.3,9.5 29.6,6 40.6,24 47.3,24 47.4,16.3 47.4,7.2 52.6,6.2 46,29 44.4,27.4 39.2,29 37.8,27.4 48.6,32.5 52.5,27.1 59.2,27.1 63.1,19.9 63,13.7 63,8.7 70.1,49.6 65.1,49.5 61.8,43.5 70.1,46.9 70.1,40.3 66.3,40.3 74,40.3 66.3,35.7 72.9,35.4 66.2,28.3 66.2,24.5 60.9,32.6 66.6,16.6 65.7,12.3 67.7,12.3 69.4,2.4 74.3,2.4 77,37 77,27 77,17 77,7 8.5,71.2 15.8,67.9 8.5,67.8 3.7,67.8 17.6,74.7 21.6,73.4 37.5,79.8 40.3,75.9 30.4,79.8 21.8,77.6 21.8,81.9 21.9,86.1 22,89.6 26.5,77.6 37.5,87.6 49.1,75.8 49.2,68.1 61.7,68.1 61.8,75.7 57.4,75.8 51.4,54 60,54 60,60.2 72.8,75.8 72.7,64.6 72.7,58.4 32.7,43.1 26.1,36.1 22.2,44.3 21.6,34.9 23.7,29 31,29.6 31.4,34.8 39.6,35.7 34.6,37.2 13.3,34.9 52.3,44.5 52,36.8 60,79.3 50.6,79.2 27.9,72.5 36.6,72
  pour Top (rank 6): 3,120 3,0 78,0 78,120
  pour Bottom (rank 6): 3,120 3,0 78,0 78,120
GNDA  (via drill 0.25)
  Top 0.406: SUPPLY7.P$1 29.7,96.3
  Bottom 0.406: SUPPLY7.P$1 29.7,96.3
  other vias: 15,101.9 15,107.3 16.8,106.1 13.2,106.1 16.8,103.1 13.2,103.1 15,100.8 16.8,99.6 13.2,99.6 15,95.4 16.8,96.6 13.2,96.6 17.8,105.4 19,105.4 20.3,105.4 21.6,105.4 17.8,103.8 19,103.8 20.3,103.8 21.6,103.8 23,105.4 24.5,105.4 25.7,104.9 26.6,104.1 23,103.8 24.3,103.7 25.4,103.1 25.7,102 25.2,101.3 27.1,103 27.3,101.7 28.2,101.3 23.9,100 29.1,100 28.6,98.8 24.5,98.8 23.9,97.5 29.1,97.5 26.5,96.9 29.1,95 23.9,95 28.6,93.8 29.1,92.5 27.8,91.3 25.3,91.3 26.5,91.8 23.9,92.5 26.5,95.6 17.6,97.3 17.6,98.9 18.9,97.3 18.9,98.9 20.2,98.7 21.3,98 22,96.9 20.2,96.9 20.6,95.8 22.1,95.6 23,94.6 20.8,94.5 21.6,93.6 22.9,93 11.2,107.1 11.2,101.1 11.2,95.1 18.7,107.1 22.7,107.1 26.7,107.1 18.7,95.1 29.7,104.6 29.7,101.1 18.7,101.1 22.2,101.1 21.7,91.6
  pour Bottom: 10.5,108 10.5,95 12,93.5 19,93.5 21.5,91 30,91 31,92 31,105 28,108
  pour Top (rank 5): 10.5,108 10.5,95 11.5,94 12,93.5 19,93.5 21.5,91 30,91 31,92 31,105 28.5,107.5 28,108
GPS_PPS  (via drill 0.25)
  Top 0.2: U10.4 69.9,81.98 70.5,81.38 70.5,80.32 70.71,80.11 C54.2 70.71,79.39 v69.18,77.86 | U1.40 63.9,52.13 66.15,54.38 66.15,75.74 65.98,75.91 65.98,77.54 v66.24,77.8
  Bottom 0.2: v66.24,77.8 66.97,78.53 68.77,78.53 69.18,78.12 v69.18,77.86
GPS_RESET
  Top 0.2: U1.41 63.7,52.63 65.56,54.49 65.56,84.42 66.3,85.16 74.13,85.16 75.4,83.89 U10.9
GPS_RX
  Top 0.2: U10.2 67.7,82.46 arc-90 C53.2 67.59,82.2 67.21,81.81 67.21,54.02 64.32,51.13 U1.38
GPS_TX  (via drill 0.25)
  Top 0.2: U10.3 68.8,81.15 | 68.8,81.15 C52.2 | U1.39 64.11,51.63 66.65,54.17 66.65,76.24 v66.59,76.3 | v67.98,77.87 68.78,78.67 68.78,80.76 68.8,80.78 68.8,81.15
  Bottom 0.2: v66.59,76.3 67.98,77.69 v67.98,77.87
GPS_WAKEUP  (via drill 0.25)
  Top 0.2: U1.42 63.49,53.13 65.15,54.79 65.15,75.63 v64.83,75.95 | U10.5 71.1,83.68 71.1,80.68 v72.17,79.61
  Bottom 0.2: v64.83,75.95 64.83,77.59 66.25,79.01 71.57,79.01 v72.17,79.61
LEAKAGE  (via drill 0.25)
  Top 0.2: U1.3 35.8,41.45 34.25,39.9 32.62,39.9 31.94,39.22 31.94,35.38 32.96,34.36 34.36,34.36 v34.38,34.34
  Bottom 0.2: v34.38,34.34 34.43,34.39 R21.1
LED
  Top 0.2: U1.37 64.51,50.63 67.65,53.77 67.65,61.47 68.23,62.05 J13.2
N$1
  Top 0.2: U1.73 35.8,61.29 C2.1
N$2
  Top 0.2: U1.48 50.91,56.13 C1.1
N$6
  Bottom 0.2: J6.2 16.66,26.51 16.66,18.52 10.29,12.15 9.78,12.15 9.02,11.38 U7.14
N$7
  Top 0.406: U2.5 73,44.96 L1.1
N$10
  Bottom 0.2: U7.13 10.29,11.4 17.21,18.33 17.21,24.52 J6.3
N$11
  Top 0.406: U3.7 69.27,32.67 C31.1
N$12
  Top 0.406: R3.2 73.08,34.28 73.9,35.1 74.9,35.1 75.08,35.28 C30.2 | C63.2 C29.2 67.32,36.69 D2.A
  Top 0.61: C30.2 72.9,36.66 C64.2 C63.2
  Top 0.813: L2.2 64.3,35.49 D2.A
N$13
  Bottom 0.2: D4.2 36.3,29.74 R18.1 | J5.2 35.99,28.27 D4.2 | D4.2
N$14
  Top 0.406: U3.6 70.53,32.79 C32.1 R5.2
N$15
  Top 0.305: U5.P$9 20.5,63.5 R6.1
N$16
  Bottom 0.2: U6.1 C34.1
N$17
  Bottom 0.2: C34.2 18.39,22.32 18.39,18.61 19.36,17.64 21.55,17.64 22.27,18.36 U6.3
N$18
  Bottom 0.2: U6.4 23.54,22 C35.1
N$19
  Bottom 0.2: U6.14 22.27,13.88 25.05,16.67 28.03,16.67 29.6,18.24 29.6,24.05 J4.2
N$21
  Bottom 0.2: J4.3 28.84,25.72 30.17,24.39 30.17,17.95 28.27,16.05 25.28,16.05 23.54,14.3 U6.13
N$22
  Bottom 0.2: U6.7 27.34,23.59 26.25,24.68 22.85,24.68 21.5,26.03 21.5,28.42 20.39,29.53 9.55,29.53 8.7,28.68 J7.2
N$23
  Top 0.406: U3.8 68,33.45 68.41,33.86 C31.2
  Top 0.813: U3.8 65.43,30.17 L2.1
N$24
  Bottom 0.2: U6.8 28.61,23.05 26.44,25.23 23.06,25.23 22.03,26.26 22.03,28.66 20.64,30.05 9.18,30.05 7.39,28.26 7.39,26.73 8.09,26.03 9.92,26.03 J7.3
N$41
  Top 0.406: R4.2 R3.1 73.08,31.78 71.81,30.5 U3.5
N$42
  Bottom 0.2: U6.5 24.58,20.1 24.58,22.64 23.61,23.61 C35.2
N$62
  Bottom 0.2: U6.2 21,21.4 C36.2
N$63
  Bottom 0.2: U6.6 26.07,21.43 C37.1
N$65
  Bottom 0.2: C40.2 5.23,22.27 5.23,18.31 6.01,17.53 8.19,17.53 9.02,18.36 U7.3
N$66
  Bottom 0.2: U7.1 6.47,21.92 C40.1
N$67
  Bottom 0.2: U7.4 10.29,21.8 C41.1
N$68
  Bottom 0.2: C41.2 11.55,22.41 U7.5
N$69
  Bottom 0.2: U7.6 12.82,21.56 C43.1
N$70
  Bottom 0.2: U7.2 7.75,21.26 C42.2
N$71
  Bottom 0.2: U8.1 58.79,75.81 R7.1
N$72
  Bottom 0.2: U8.12 55.89,75.87 R8.1
N$73
  Bottom 0.2: R7.2 59.8,77.09 | 59.8,77.09 C44.1 | J9.3 67.97,70.73 61.61,77.09 59.8,77.09
N$90
  Bottom 0.2: R8.2 54.94,77.11 C45.1 54.96,77.77 55.54,78.35 61.22,78.35 66.3,73.27 J9.2
N$91
  Bottom 0.2: C46.2 L3.2
  Bottom 0.61: J9.4 69.16,68.19 64.17,73.19 L3.2
N$92
  Top 0.2: C51.1 74.31,82.45 | 74.31,82.45 U10.8 U10.7 | L4.1 74.33,82.43 74.31,82.45
N$94  (via drill 0.25)
  Top 0.2: v53.7,73.1 60.7,73.1 v61.9,74.3
  Bottom 0.2: U8.9 55.06,73.27 54.9,73.1 v53.7,73.1 | v61.9,74.3 61.5,73.9 60.54,73.9 C49.1 60.36,73.72 U8.3 U8.2
N$100
  Top 0.2: C56.2 FL1.4
N$101
  Top 0.2: U10.11 74.3,94.76 C56.1
N$102
  Top 0.2: FL1.1 U11.3
N$103
  Top 0.2: U11.5 L5.1
N$104
  Top 0.2: L5.2 73.65,101.42 C57.1
N$107
  Top 0.2: C57.2 73.64,103.56 Y3.2
N$108  (via drill 0.25)
  Top 0.305: BT2.P 24.79,54.37 v23.07,56.09 | v30.3,76.54 31.71,77.95 v33.24,77.95
  Bottom 0.305: v23.07,56.09 21.3,57.86 21.3,69.41 28.43,76.54 v30.3,76.54 | v33.24,77.95 39.91,71.28 39.91,68.8 40.95,67.77 U12.14
N$115
  Top 0.406: T1.1 56.44,2.15 65.82,2.15 66.19,2.52 D3.2 67.83,3.94 R17.1
N$118
  Top 0.406: J1.1 23.43,93.75 arc-90 21.35,95.83 21.35,95.99 arc90 19.24,98.1 Y4.2
N$119
  Bottom 0.2: R19.2 R18.2 32.17,30.64 U15.1
N$120
  Top 0.406: J2.1 26.5,102.06 arc90 23.96,104.6 Y5.2
N$121
  Bottom 0.2: U15.3 34.54,33.14 R20.1 36.3,34.11 R21.2
N$123
  Top 0.406: U2.3 70.86,41.26 R2.2
N$125
  Bottom 0.2: U8.4 59.3,73.27 | 59.3,73.27 60.03,73.27 60.03,73.26 61.81,73.26 L3.1 | 59.3,73.27 59.9,72.67 C47.1 59.84,71.72 C48.2 59.78,70.71 D5.A
NETWORKINT
  Top 0.2: U1.61 41.8,78.15 37.95,82 34.23,82 30.16,77.93 28.16,77.93 J12.19
ON/OFF  (via drill 0.25)
  Top 0.2: U1.60 42.3,78.36 38.16,82.5 33.36,82.5 v33.13,82.27 | J12.5 v30.16,86.86
  Bottom 0.2: v33.13,82.27 33.13,83.85 31.91,85.07 31.91,85.11 v30.16,86.86
OSC32_IN
  Top 0.2: C7.1 33.35,36.63 Y2.1 33.72,38.4 35.8,40.48 36.97,40.48 38.3,41.81 U1.8
OSC32_OUT
  Top 0.2: C6.1 35.85,36.62 Y2.2 35.85,39.54 36.31,40 37.2,40 38.8,41.6 U1.9
OSC_IN
  Top 0.2: C5.1 38.35,35.58 Y1.1 38.86,37 39.5,37.64 39.5,39.51 40.3,40.31 U1.12
OSC_OUT
  Top 0.2: C4.1 41.18,35.53 41.65,36 41.65,37.8 Y1.3 40.8,38.95 U1.13
PG  (via drill 0.25)
  Top 0.406: U3.4 73.53,26.95 73.53,29.25 73.48,29.3 v73.48,30.06 | R5.1 v71.84,35.23 v71.85,35.24
  Bottom 0.406: v73.48,30.06 73.48,33.59 v71.84,35.23 v71.85,35.24
POWER_SCL  (via drill 0.25)
  Top 0.2: U14.6 70.62,13.56 R16.1 70.72,13.24 v70.12,12.64 | U1.67 38.8,66.56 35.06,70.3 30.51,70.3 29.16,68.95 29.16,64.03 v27.63,62.5 | v22.36,62.1 20.76,62.1 17.76,59.1 6.57,59.1 4.35,56.88 4.35,8.45 11.35,1.45 50.34,1.45 v52.14,3.25
  Bottom 0.2: v27.63,62.5 22.76,62.5 v22.36,62.1 | v52.14,3.25 60.73,3.25 v70.12,12.64
POWER_SDA  (via drill 0.25)
  Top 0.2: U14.7 69.97,14.06 70.67,14.76 R15.1 71.45,14.02 72.07,14.02 72.21,13.88 72.21,12.4 71.77,11.95 69.84,11.95 v69.13,12.66 | U1.90 22.23,50.13 v20.75,51.61 | v15.39,56.57 13.38,58.58 6.89,58.58 4.88,56.57 4.88,8.56 11.53,1.91 49.44,1.91 v50.82,3.29
  Bottom 0.2: v15.39,56.57 15.79,56.57 v20.75,51.61 | v50.82,3.29 51.48,3.95 60.42,3.95 v69.13,12.66
RS232_1_RX  (via drill 0.25)
  Top 0.2: U1.97 22.37,46.63 19.42,43.68 19.42,37.83 20.75,36.5 21.91,36.5 30.05,28.37 30.05,14.64 28.79,13.38 v25.01,13.38
  Bottom 0.2: U6.12 24.8,13.18 v25.01,13.38
RS232_1_TX  (via drill 0.25)
  Top 0.2: U1.98 22.58,46.13 19.92,43.47 19.92,38.04 20.95,37 22.13,37 30.49,28.64 30.49,14.27 28.87,12.65 v26.2,12.65
  Bottom 0.2: U6.11 26.07,12.53 v26.2,12.65
RS232_2_RX  (via drill 0.25)
  Top 0.2: U1.26 49.16,45.13 50.81,43.48 50.81,40.29 49.69,39.17 v49.69,35.57 | v49.72,34.02 49.72,33.9 49.18,33.36 48.57,33.36 48.37,33.56 41.19,33.56 39.24,31.61 37.36,31.61 36.35,30.6 36.35,26.88 34.23,24.76 34.23,12.04 27.57,5.38 13.33,5.38 11.56,7.15 v11.56,8.14
  Bottom 0.2: v49.69,35.57 49.69,34.05 v49.72,34.02 | U7.12 v11.55,8.14 v11.56,8.14
RS232_2_TX  (via drill 0.25)
  Top 0.2: U1.25 46.8,41.73 49.07,39.46 49.07,35.76 v48.84,35.53 | v48.87,34.03 46.93,34.03 46.92,34.02 40.92,34.02 38.96,32.06 36.18,32.06 33.81,29.69 33.81,12.31 27.3,5.8 13.62,5.8 12.84,6.58 v12.84,8.11
  Bottom 0.2: v48.84,35.53 48.84,34.06 v48.87,34.03 | U7.11 12.82,8.12 v12.84,8.11
RS232_3_RX  (via drill 0.25)
  Top 0.2: U1.24 46.3,41.52 48.57,39.25 48.57,36.22 v47.69,35.34 | v39.18,33.18 38.59,32.59 35.9,32.59 31.4,28.09 31.4,11.18 v28.66,8.44
  Bottom 0.2: U6.9 28.61,8.48 v28.66,8.44 | v39.18,33.18 41.4,35.4 45.47,35.4 46.37,34.5 47.09,34.5 47.69,35.1 v47.69,35.34
RS232_3_TX  (via drill 0.25)
  Top 0.2: U1.23 45.8,41.32 48.07,39.05 48.07,36.61 v46.78,35.32 | v38.25,33.22 35.85,33.22 30.95,28.32 30.95,12.04 v27.34,8.43
  Bottom 0.2: U6.10 v27.34,8.44 v27.34,8.43 | v38.25,33.22 38.28,33.25 38.4,33.25 40.93,35.78 46.32,35.78 v46.78,35.32
RST  (via drill 0.25)
  Top 0.2: SW1.3 54.85,58.89 C3.1 v52.34,58.72 | U1.14 41.3,40.08 42.05,39.33 v42.05,38.7 | SW1.4 SW1.3 | SW1.3 57.55,59.65 J8.3
  Bottom 0.2: v52.34,58.72 52.3,58.76 49.04,58.76 48,57.72 48,44.5 47.5,44 43.5,44 42.05,42.55 v42.05,38.7
RTC_INT1  (via drill 0.25)
  Top 0.2: U1.69 37.8,65.72 34.59,68.93 v30.99,68.93
  Bottom 0.2: U12.3 33.3,67.71 R12.1 30.99,67.73 v30.99,68.93
RTC_SCL  (via drill 0.25)
  Top 0.2: U1.47 51.7,55.63 52.23,56.16 52.23,57.73 48.02,61.94 48.02,62.98 v47.58,63.42
  Bottom 0.2: U12.16 44.89,65.22 | 44.89,65.22 R11.1 | v47.58,63.42 46.7,63.42 44.89,65.22
RTC_SDA  (via drill 0.25)
  Top 0.2: U1.89 23.23,50.63 22.19,51.67 v21.92,51.67
  Bottom 0.2: R10.1 U12.15 40.94,66.5 39.18,68.25 39.18,71.07 32.96,77.29 27.41,77.29 19.94,69.82 19.94,53.65 v21.92,51.67
SDIO_CK  (via drill 0.25)
  Top 0.2: U1.80 29.78,55.13 28.08,56.83 20.97,56.83 18.3,54.16 18.3,29.95 16.26,27.91 16.26,26.62 15.48,25.84 13.89,25.84 12.29,24.24 11.02,24.24 11,24.26 9.68,22.94 9.68,7.69 12.81,4.56 36.08,4.56 40.3,8.78 v40.3,16.74
  Bottom 0.2: v40.3,16.74 41.72,18.16 J10.5
SDIO_CMD  (via drill 0.25)
  Top 0.2: U1.83 29.72,53.63 28.62,52.53 19.7,52.53 18.81,51.64 18.81,26.74 17.49,25.42 14.05,25.42 12.4,23.77 11.2,23.77 10.15,22.72 10.15,7.9 13.09,4.96 35.83,4.96 39.6,8.73 v39.6,17.94
  Bottom 0.2: v39.6,17.94 39.6,20.09 J10.3
SDIO_D0  (via drill 0.25)
  Top 0.2: U1.65 39.8,66.98 35.4,71.38 29.92,71.38 28.14,69.6 28.14,64.75 22.77,59.38 19.81,59.38 15.98,55.54 15.98,33.49 11.81,29.32 8.78,29.32 7.43,27.97 7.43,6.65 11.72,2.36 37.32,2.36 42.95,7.99 42.95,9.77 42.96,9.78 42.96,12.21 v43.93,13.18
  Bottom 0.2: v43.93,13.18 J10.7
SDIO_D1  (via drill 0.25)
  Top 0.2: U1.66 39.3,66.77 35.24,70.83 30.21,70.83 28.63,69.25 28.63,64.53 22.98,58.88 20.02,58.88 16.33,55.19 16.33,33.13 11.93,28.73 10.8,28.73 9.97,27.9 9.97,26.32 7.89,24.24 7.89,6.87 11.97,2.79 37.1,2.79 42.47,8.16 42.47,12.79 43.96,14.28 v44.64,14.28
  Bottom 0.2: v44.64,14.28 44.64,17.25 45.05,17.66 45.05,20.14 J10.8
SDIO_D2  (via drill 0.25)
  Top 0.2: U1.78 30.19,56.13 28.5,57.82 20.55,57.82 17.34,54.61 17.34,32.5 12.97,28.13 12.97,26.32 11.89,25.24 10.55,25.24 8.75,23.44 8.75,7.27 12.34,3.68 36.7,3.68 41.49,8.47 41.49,14.12 v41.72,14.35
  Bottom 0.2: v41.72,14.35 40.29,14.35 37.32,17.32 J10.1
SDIO_D3  (via drill 0.25)
  Top 0.2: U1.79 29.99,55.63 28.31,57.3 20.74,57.3 17.81,54.38 17.81,32.13 13.49,27.81 13.49,26.12 12.13,24.76 10.78,24.76 9.22,23.2 9.22,7.48 12.57,4.13 36.42,4.13 40.99,8.7 v40.99,15.57
  Bottom 0.2: v40.99,15.57 40.02,15.57 38.42,17.17 J10.2
TTL_RX  (via drill 0.25)
  Top 0.2: U1.1 34.8,41.92 33.73,40.85 32.3,40.85 30.36,38.91 30.36,36.07 v28.52,34.23 | v44.04,6 v44.04,3.92
  Bottom 0.2: v28.52,34.23 28.99,33.76 28.99,29.7 30.78,27.91 30.78,24.14 34.05,20.87 34.05,8.48 36.19,6.35 43.69,6.35 v44.04,6 | v44.04,3.92 46.15,1.81 63.56,1.81 75.67,13.92 75.67,47.54 71.25,51.95 71.17,52.04 70.35,52.86 J14.3
TTL_TX  (via drill 0.25)
  Top 0.2: U1.2 35.3,41.71 33.94,40.35 32.42,40.35 30.86,38.79 30.86,35.63 v29.46,34.23 | v45.12,5.99 v45.12,3.89
  Bottom 0.2: v29.46,34.23 29.46,29.9 31.25,28.11 31.25,24.34 34.52,21.07 34.52,8.68 36.38,6.82 44.29,6.82 v45.12,5.99 | v45.12,3.89 46.75,2.26 63.37,2.26 75.22,14.11 75.22,47.35 70.75,51.82 69.6,51.82 68.85,52.57 68.85,54.82 69.91,55.88 J14.2
USB_RX  (via drill 0.25)
  Top 0.2: U1.51 46.8,71.36 48.67,73.23 52.6,73.23 53.49,72.34 v54.39,72.34
  Bottom 0.2: U8.7 54.41,72.36 v54.39,72.34
USB_TX  (via drill 0.25)
  Top 0.2: U1.52 46.3,71.57 48.46,73.73 v54.42,73.73
  Bottom 0.2: U8.10 54.44,73.72 v54.42,73.73
V+
  Top 0.406: 69.68,10.65 RS1.1 66.77,10.02 66.77,13.98 66.19,14.56 | U14.3 66.19,14.56 | U14.2 65.69,15.06 | 65.69,15.06 66.19,14.56 | U14.1 65.19,15.56 65.69,15.06
  pour Top (no thermals): 58.88,5.78 63.15,5.78 65.93,8.56 65.93,11.34 69.77,11.34 69.77,6.34 68.84,5.41 65.62,5.41 63.04,2.83 58.88,2.83
VBAT  (via drill 0.25)
  Top 0.305: v72.13,82.25 72.13,83.75 U10.6
  Top 0.406: BT1.P 28.27,41.11 C24.1 25.51,41.11 v24.82,41.8
  Bottom 0.2: 4,64.56 11.34,71.9
  Bottom 0.305: v24.82,41.8 7.65,41.8 4,45.45 4,64.56 | 11.34,71.9 11.34,82.53 19.26,90.45 40.8,90.45 49,82.25 v72.13,82.25
VCC  (via drill 0.25)
  Top 0.2: U1.21 44.8,42.42 v44.38,42 | v49.73,43.14 49.63,43.04 v47.66,43.04 | U4.2 v64.36,47.39 v64.35,47.4
  Bottom 0.2: C22.1 C20.1 44.38,41.01 v44.38,42 45.42,43.04 v47.66,43.04 | v49.73,43.14 60.09,43.14 v64.35,47.4
VCC_RF
  Top 0.2: U11.2 73.65,98 73.49,97.84 72.13,97.84 | 72.13,97.84 C58.1 | 72.13,97.84 71.56,97.84 71.04,97.32 C55.2 71,94.98 U10.14
VIN
  pour Top (no thermals): 47.34,28.11 47.79,28.56 49.29,28.56 49.96,27.89 49.96,27.15 51.88,25.23 54.84,25.23 55.59,24.48 55.59,20.65 56.19,20.05 61.79,20.05 62.08,19.76 62.08,7.49 51.55,7.49 51.55,20.75 47.34,26.25

## Text on the board
tPlace: GPS / INTERNAL | Iridium Satellite 9602N Modem | ANT | IRIDIUM | GPS | Bluetooth | GPS / POWER | GND | USB | DP | DM | 5V | GND | BT-POWER | DEBUGGER | LED | LED | DIO | CLK | RST | GND | 5V | GND | TX | TTL | RX | DIO | CLK | BT Firm | RST | Y | X | Krakatau Board v1.3 | + | GND | TX-3 | RX-3 | GND | TX-2 | RX-2 | GND | TX-1 | RX-1 | GND | GND | + | GND | + | RS232-3 / Inductive | RS232-2 / Acoustic | RS232-1 / BPR | Leakage / Sensor Port | Power / Output | Power / Input
bPlace: Badan Pengkajian dan Penerapan Teknologi (BPPT) | Agency for the Assessment and Application of Technology (BPPT) | ANT | Quality Control / Check | IRIDIUM | GPS | GND | DP | DM | 5V | GND | DEBUGGER | LED | DIO | CLK | RST | GND | 5V | GND | TX | RX | DIO | BT Firm | CLK | RST | Board Number | GND | TX-3 | RX-3 | GND | TX-2 | RX-2 | GND | TX-1 | RX-1 | GND | + | GND | + | GND | + | SDCard | Center for Electronics Technology | Made In Indonesia | Pusat Teknologi Elektronika